# EAGLE design ASD2413 (EAGLE 6.3)
DATABASE: ./../../../../../Components/TinyCircuits_Part_Database.txt
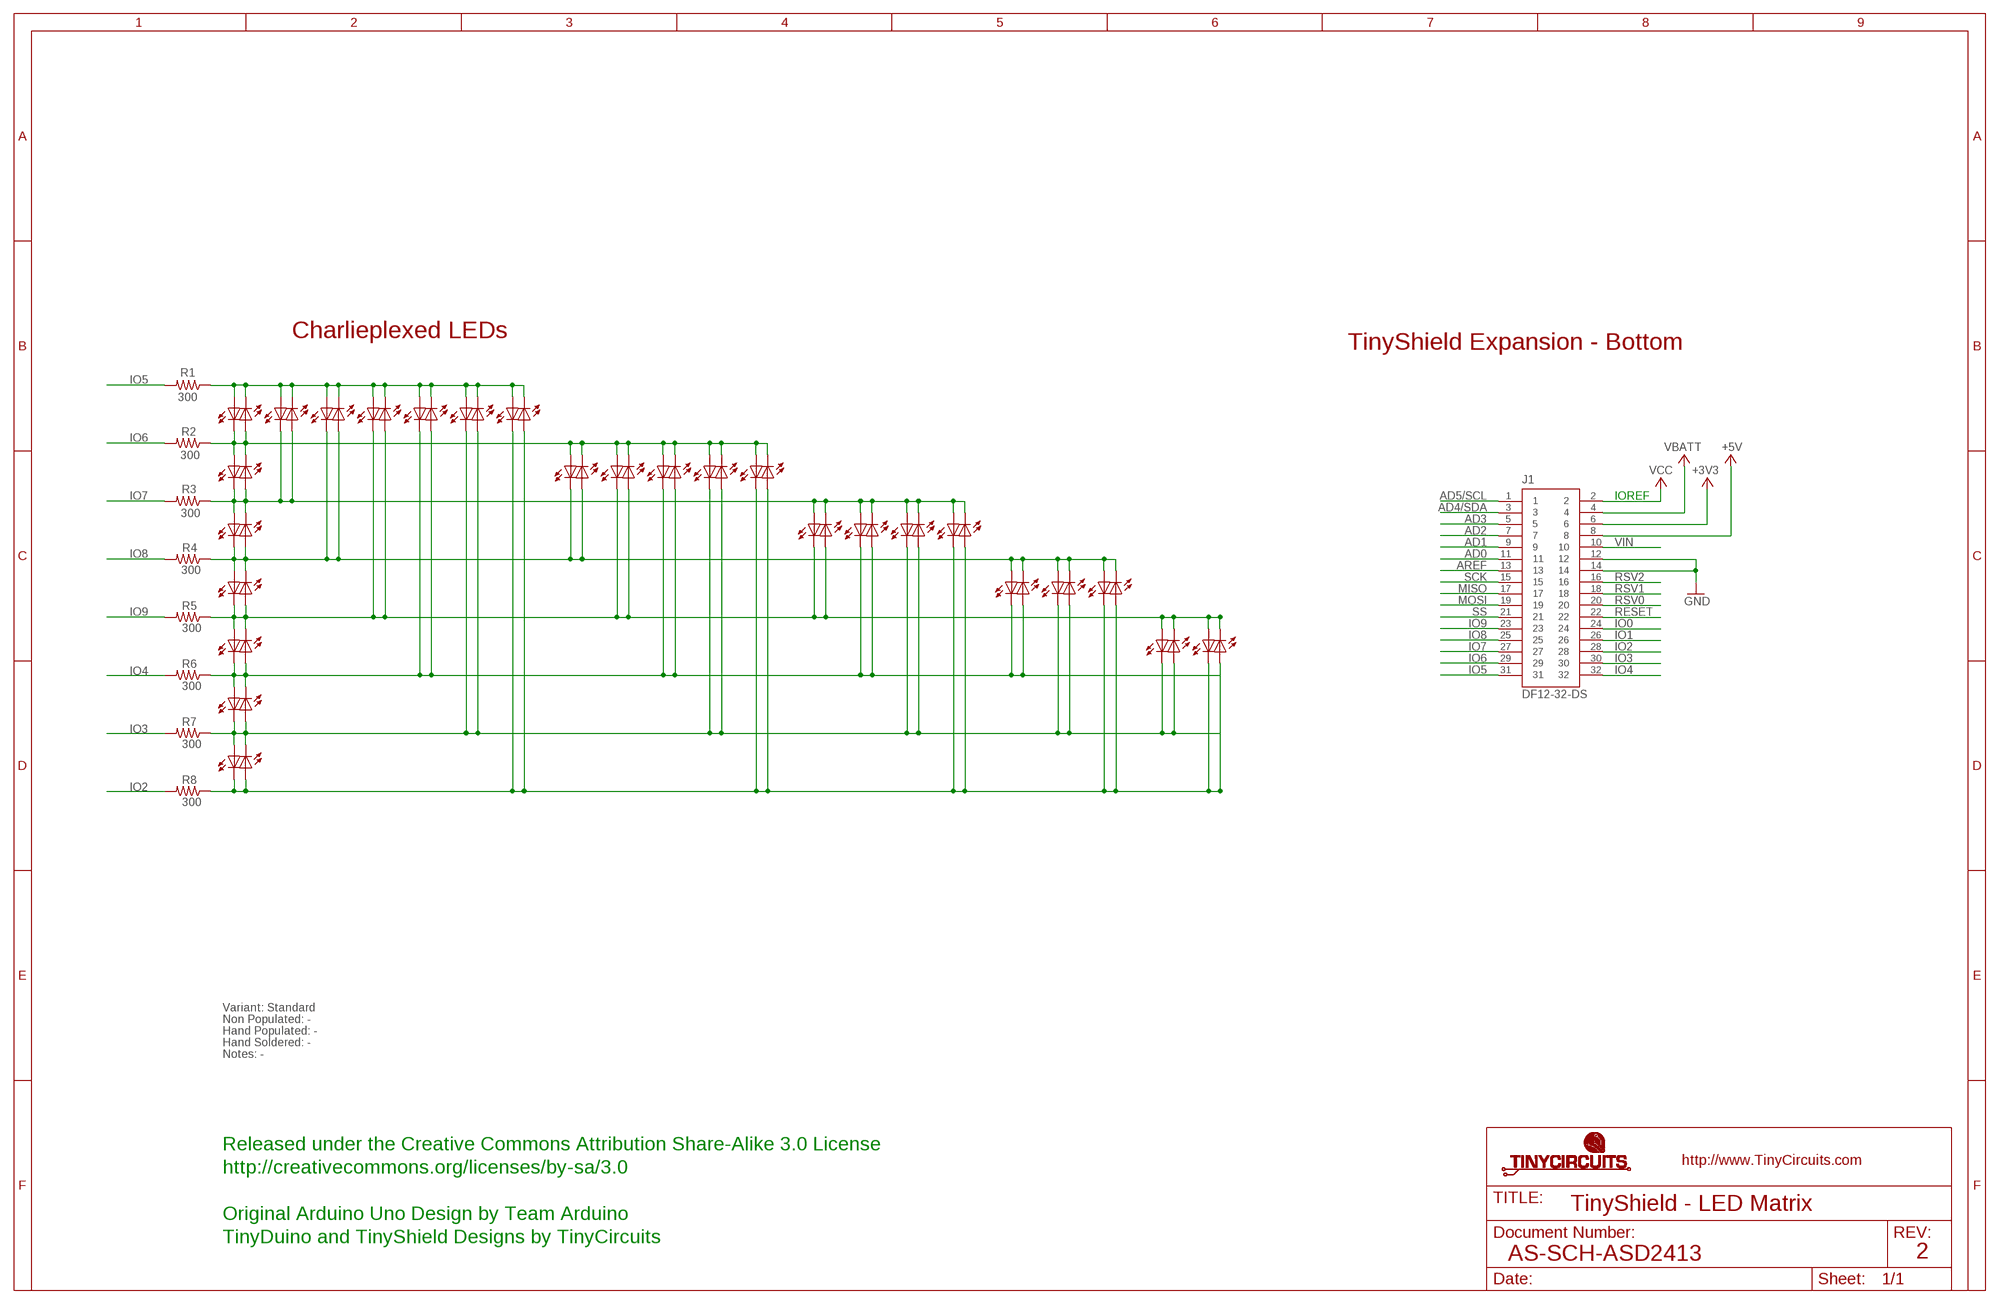
[diagram p0: schematic, sheet 1]

## Parts
D1  GREEN  AS-ITM-00038  [0402_LED]
D2  GREEN  AS-ITM-00038  [0402_LED]
D3  GREEN  AS-ITM-00038  [0402_LED]
D4  GREEN  AS-ITM-00038  [0402_LED]
D5  GREEN  AS-ITM-00038  [0402_LED]
D6  GREEN  AS-ITM-00038  [0402_LED]
D7  GREEN  AS-ITM-00038  [0402_LED]
D8  GREEN  AS-ITM-00038  [0402_LED]
D9  GREEN  AS-ITM-00038  [0402_LED]
D10  GREEN  AS-ITM-00038  [0402_LED]
D11  GREEN  AS-ITM-00038  [0402_LED]
D12  GREEN  AS-ITM-00038  [0402_LED]
D13  GREEN  AS-ITM-00038  [0402_LED]
D14  GREEN  AS-ITM-00038  [0402_LED]
D15  GREEN  AS-ITM-00038  [0402_LED]
D16  GREEN  AS-ITM-00038  [0402_LED]
D17  GREEN  AS-ITM-00038  [0402_LED]
D18  GREEN  AS-ITM-00038  [0402_LED]
D19  GREEN  AS-ITM-00038  [0402_LED]
D20  GREEN  AS-ITM-00038  [0402_LED]
D21  GREEN  AS-ITM-00038  [0402_LED]
D22  GREEN  AS-ITM-00038  [0402_LED]
D23  GREEN  AS-ITM-00038  [0402_LED]
D24  GREEN  AS-ITM-00038  [0402_LED]
D25  GREEN  AS-ITM-00038  [0402_LED]
D26  GREEN  AS-ITM-00038  [0402_LED]
D27  GREEN  AS-ITM-00038  [0402_LED]
D28  GREEN  AS-ITM-00038  [0402_LED]
D29  GREEN  AS-ITM-00038  [0402_LED]
D30  GREEN  AS-ITM-00038  [0402_LED]
D31  GREEN  AS-ITM-00038  [0402_LED]
D32  GREEN  AS-ITM-00038  [0402_LED]
D33  GREEN  AS-ITM-00038  [0402_LED]
D34  GREEN  AS-ITM-00038  [0402_LED]
D35  GREEN  AS-ITM-00038  [0402_LED]
D36  GREEN  AS-ITM-00038  [0402_LED]
D37  GREEN  AS-ITM-00038  [0402_LED]
D38  GREEN  AS-ITM-00038  [0402_LED]
D39  GREEN  AS-ITM-00038  [0402_LED]
D40  GREEN  AS-ITM-00038  [0402_LED]
D41  GREEN  AS-ITM-00038  [0402_LED]
D42  GREEN  AS-ITM-00038  [0402_LED]
D43  GREEN  AS-ITM-00038  [0402_LED]
D44  GREEN  AS-ITM-00038  [0402_LED]
D45  GREEN  AS-ITM-00038  [0402_LED]
D46  GREEN  AS-ITM-00038  [0402_LED]
D47  GREEN  AS-ITM-00038  [0402_LED]
D48  GREEN  AS-ITM-00038  [0402_LED]
D49  GREEN  AS-ITM-00038  [0402_LED]
D50  GREEN  AS-ITM-00038  [0402_LED]
D51  GREEN  AS-ITM-00038  [0402_LED]
D52  GREEN  AS-ITM-00038  [0402_LED]
D53  GREEN  AS-ITM-00038  [0402_LED]
D54  GREEN  AS-ITM-00038  [0402_LED]
J1  DF12-32-DS  AS-ITM-00012  [DF12-32-DS]
R1  300  AS-ITM-00016  [0402]
R2  300  AS-ITM-00016  [0402]
R3  300  AS-ITM-00016  [0402]
R4  300  AS-ITM-00016  [0402]
R5  300  AS-ITM-00016  [0402]
R6  300  AS-ITM-00016  [0402]
R7  300  AS-ITM-00016  [0402]
R8  300  AS-ITM-00016  [0402]

## Nets
+3V3: J1.6
+5V: J1.8
AD0: J1.11
AD1: J1.9
AD2: J1.7
AD3: J1.5
AD4/SDA: J1.3
AD5/SCL: J1.1
AREF: J1.13
GND: J1.12 J1.14
IO0: J1.24
IO1: J1.26
IO2: J1.28 R8.2
IO3: J1.30 R7.2
IO4: J1.32 R6.2
IO5: J1.31 R1.2
IO6: J1.29 R2.2
IO7: J1.27 R3.2
IO8: J1.25 R4.2
IO9: J1.23 R5.2
MISO: J1.17
MOSI: J1.19
N$2: D1.2(C) D2.1(A) D8.1(A) D9.2(C) D27.1(A) D28.2(C) D29.1(A) D30.2(C) D31.1(A) D32.2(C) D33.1(A) D34.2(C) D35.1(A) D36.2(C) R2.1
N$5: D3.2(C) D4.1(A) D10.1(A) D11.2(C) D17.2(C) D18.1(A) D27.2(C) D28.1(A) D45.1(A) D46.2(C) D47.1(A) D48.2(C) D49.1(A) D50.2(C) R4.1
N$6: D5.2(C) D6.1(A) D12.1(A) D13.2(C) D21.2(C) D22.1(A) D31.2(C) D32.1(A) D39.2(C) D40.1(A) D45.2(C) D46.1(A) R6.1
N$7: D7.2(C) D14.1(A) D25.2(C) D26.1(A) D35.2(C) D36.1(A) D43.2(C) D44.1(A) D49.2(C) D50.1(A) D53.2(C) D54.1(A) R8.1
N$11: D1.1(A) D8.2(C) D15.1(A) D16.2(C) D17.1(A) D18.2(C) D19.1(A) D20.2(C) D21.1(A) D22.2(C) D23.1(A) D24.2(C) D25.1(A) D26.2(C) R1.1
N$13: D2.2(C) D3.1(A) D9.1(A) D10.2(C) D15.2(C) D16.1(A) D37.1(A) D38.2(C) D39.1(A) D40.2(C) D41.1(A) D42.2(C) D43.1(A) D44.2(C) R3.1
N$14: D6.2(C) D7.1(A) D13.1(A) D14.2(C) D23.2(C) D24.1(A) D33.2(C) D34.1(A) D41.2(C) D42.1(A) D47.2(C) D48.1(A) D51.2(C) D52.1(A) R7.1
N$15: D4.2(C) D5.1(A) D11.1(A) D12.2(C) D19.2(C) D20.1(A) D29.2(C) D30.1(A) D37.2(C) D38.1(A) D51.1(A) D52.2(C) D53.1(A) D54.2(C) R5.1
RESET: J1.22
RSV0: J1.20
RSV1: J1.18
RSV2: J1.16
SCK: J1.15
SS: J1.21
VBATT: J1.4
VCC: J1.2
VIN: J1.10

## Notes on the sheet
- Charlieplexed LEDs
- TinyShield Expansion - Bottom
- IOREF
- Variant: Standard
- Non Populated: -
- Hand Populated: -
- Hand Soldered: -
- Notes: -
- Released under the Creative Commons Attribution Share-Alike 3.0 License
- http://creativecommons.org/licenses/by-sa/3.0
- TinyShield - LED Matrix
- Original Arduino Uno Design by Team Arduino
- TinyDuino and TinyShield Designs by TinyCircuits
- AS-SCH-ASD2413 | 2

## Library data of the parts
D1-D54 = tinycircuits:AS-ITM-00038: LED 0402 GREEN WTR CLR SMD; PARTNO: AS-ITM-00038
J1 = tinycircuits:AS-ITM-00012: CONN RECEPT 32POS 3MM SMD 0.5MM; PARTNO: AS-ITM-00012
R1-R8 = tinycircuits:AS-ITM-00016: RES 300 OHM 1/16W 1% 0402; PARTNO: AS-ITM-00016

## Board
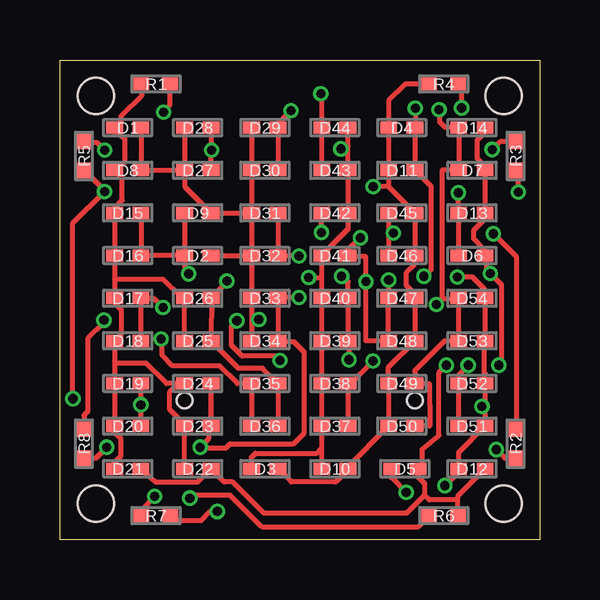
[diagram p1: board, top side]
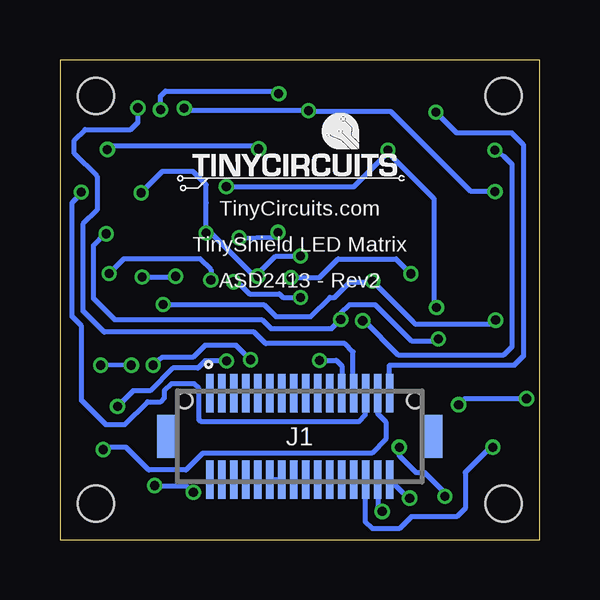
[diagram p2: board, bottom side, seen from below]

Size 20 x 20 mm. Coordinates in mm from the lower left corner, seen from the top.
Outline: 0,20 20,20 20,0 0,0 0,20
Copper layers (1*16): Top 0.035mm / dielectric 1.5mm / Bottom 0.035mm
Design rules "default *": minimum track width 8mil, minimum drill 12mil, track to track 7mil, track to pad 7mil, pad to pad 7mil, via to via 7mil, smd to smd 7mil, copper to edge 7mil, drill to drill 7mil, minimum pad ring 10mil, minimum via ring 5mil, stop-mask expansion 4mil, vias tented up to drill 25mil, thermal gap 10mil
Holes 1.5 mm at 1.5,18.5 18.5,18.5 18.5,1.5 1.5,1.5

### Footprints (pad centres in the part's own frame; a part is rotated, then mirrored left to right if it is on the bottom)
0402_LED = smd 0.7 x 0.5: 1 -0.55,0; 2 0.55,0
DF12-32-DS = smd 0.3 x 1.6: 1 -3.75,1.8; 2 -3.75,-1.8; 3 -3.25,1.8; 4 -3.25,-1.8; 5 -2.75,1.8; 6 -2.75,-1.8; 7 -2.25,1.8; 8 -2.25,-1.8; 9 -1.75,1.8; 10 -1.75,-1.8; 11 -1.25,1.8; 12 -1.25,-1.8; 13 -0.75,1.8; 14 -0.75,-1.8; 15 -0.25,1.8; 16 -0.25,-1.8; 17 0.25,1.8; 18 0.25,-1.8; 19 0.75,1.8; 20 0.75,-1.8; 21 1.25,1.8; 22 1.25,-1.8; 23 1.75,1.8; 24 1.75,-1.8; 25 2.25,1.8; 26 2.25,-1.8; 27 2.75,1.8; 28 2.75,-1.8; 29 3.25,1.8; 30 3.25,-1.8; 31 3.75,1.8; 32 3.75,-1.8 | smd 0.9 x 1.8: F1 -5.5,0; F2 5.5,0 | hole 0.65: -4.8,1.5; 4.8,1.5
0402 = smd 0.65 x 0.55: 1 -0.6,0; 2 0.6,0

### Placement (x,y rotation side)
D1  2.83,17.18 0 top
D2  5.75,11.84 180 top
D3  8.54,2.95 0 top
D4  14.26,17.18 0 top
D5  14.38,2.95 0 top
D6  17.18,11.84 0 top
D7  17.18,15.4 180 top
D8  2.83,15.4 180 top
D9  5.75,13.62 0 top
D10  11.46,2.95 180 top
D11  14.26,15.4 180 top
D12  17.18,2.95 180 top
D13  17.18,13.62 180 top
D14  17.18,17.18 0 top
D15  2.83,13.62 0 top
D16  2.83,11.84 180 top
D17  2.83,10.07 0 top
D18  2.83,8.29 180 top
D19  2.83,6.51 0 top
D20  2.83,4.73 180 top
D21  2.83,2.95 0 top
D22  5.75,2.95 180 top
D23  5.75,4.73 0 top
D24  5.75,6.51 180 top
D25  5.75,8.29 0 top
D26  5.75,10.07 180 top
D27  5.75,15.4 0 top
D28  5.75,17.18 180 top
D29  8.54,17.18 0 top
D30  8.54,15.4 180 top
D31  8.54,13.62 0 top
D32  8.54,11.84 180 top
D33  8.54,10.07 0 top
D34  8.54,8.29 180 top
D35  8.54,6.51 0 top
D36  8.54,4.73 180 top
D37  11.46,4.73 0 top
D38  11.46,6.51 180 top
D39  11.46,8.29 0 top
D40  11.46,10.07 180 top
D41  11.46,11.84 0 top
D42  11.46,13.62 0 top
D43  11.46,15.4 180 top
D44  11.46,17.18 0 top
D45  14.26,13.62 180 top
D46  14.26,11.84 0 top
D47  14.26,10.07 180 top
D48  14.26,8.29 0 top
D49  14.26,6.51 0 top
D50  14.26,4.73 180 top
D51  17.18,4.73 180 top
D52  17.18,6.51 0 top
D53  17.18,8.29 180 top
D54  17.18,10.07 0 top
J1  10,4.3 0 bottom
R1  4,19 0 top
R2  19,4 270 top
R3  19,16 270 top
R4  16,19 0 top
R5  1,16 90 top
R6  16,1 180 top
R7  4,1 0 top
R8  1,4 270 top
U$1  [DOCFIELD-TINYCIRCUITS-PCB]  33.91,-10 0 top  (outside the outline)

### Tracks (layer width: path | path; a pad name or v marks a point on that pad's centre or on a via)
+3V3
  Bottom 0.254: 12.74,2.51 J1.6
GND
  Bottom 0.254: J1.12 J1.14
IO2  (via drill 0.38)
  Top 0.203: R8.2 1.5,3.4 v1.95,3.85
  Bottom 0.203: J1.28 7.27,2.5 7.27,0.75 6.97,0.45 5.85,0.45 5.35,0.95 3.45,0.95 3.1,1.3 3.1,2.8 2.05,3.85 v1.95,3.85
IO3  (via drill 0.38)
  Top 0.203: R7.2 4.8,0.8 5.9,0.8 6.27,1.17 v6.56,1.17
  Bottom 0.203: 6.76,2.5 J1.30 6.75,1.36 v6.56,1.17
IO4  (via drill 0.38)
  Top 0.203: v5.42,1.72 5.54,1.85 7.1,1.85 8.41,0.54 14.94,0.54 R6.2
  Bottom 0.203: 6.21,3.14 6.26,3.14 | v5.42,1.72 5.68,1.92 J1.32
  Bottom 0.254: 6.21,3.14 6.26,3.1 J1.32
IO5  (via drill 0.38)
  Top 0.203: v4.32,17.82 4.59,18.12 R1.2
  Bottom 0.203: J1.31 6.26,7.27 1.05,7.27 0.67,7.65 0.67,16.47 1.15,16.95 3.45,16.95 v4.32,17.82
IO6  (via drill 0.38)
  Top 0.203: R2.2 18.55,3.4 v18.2,3.75
  Bottom 0.203: J1.29 6.76,6.1 | 6.71,6.06 J1.29 | J1.29 6.75,5.25 6.41,4.91 6.41,4.19 7,3.6 14.05,3.6 14.75,2.9 16.3,2.9 17.25,3.85 18.1,3.85 v18.2,3.75
IO7  (via drill 0.38)
  Top 0.203: R3.2 19.01,15.31 19.1,15.15 19.1,14.51 v19.11,14.49
  Bottom 0.203: J1.27 7.27,6.1 7.27,5.19 7.55,4.91 14.11,4.91 14.2,5 14.2,6.3 14.4,6.5 15.35,6.5 15.65,6.2 15.65,5.9 15.8,5.75 16.35,5.75 17.3,4.8 18.1,4.8 19.1,5.8 19.1,8.9 19.5,9.3 19.5,14.05 19.11,14.44 v19.11,14.49
IO8  (via drill 0.38)
  Top 0.203: 16.59,19.04 R4.2 16.75,18.78 v16.75,18
  Bottom 0.203: J1.25 7.78,6.1 7.78,7.83 8.12,8.18 11.43,8.18 11.9,8.65 18.15,8.65 19.05,9.55 19.05,13.15 18.45,13.75 18.45,15.15 19.4,16.1 19.4,16.65 18.95,17.1 17.05,17.1 16.75,17.4 v16.75,18
IO9  (via drill 0.38)
  Top 0.203: v9.18,7.47 9,7.65 7.6,7.65 7.15,8.1 7.15,8.9 v7.37,9.13 | v1.87,16.24 v1.86,16.24 1.55,16.55 1.05,16.55 R5.2
  Bottom 0.203: v7.37,9.13 7.33,9.13 5.9,7.7 1.48,7.7 1.15,8.03 1.15,15.65 1.49,15.99 v1.87,16.24 | v9.18,7.47 8.47,7.47 8.25,7.25 J1.23
N$2  (via drill 0.38)
  Top 0.203: D1.2 D8.1 D27.1 | D28.2 D27.1 | D27.1 5.2,14.72 D9.2 D31.1 | D29.1 D30.2 D31.1 | D31.1 D32.2 | D32.2 D33.1 7.99,9.18 | 7.99,9.18 D34.2 | D36.2 D35.1 7.4,6.51 6.66,7.25 4.7,7.25 4.25,7.7 4.25,8.34 v4.22,8.36 | v8.29,9.18 7.99,9.18 | D2.1 D32.2 | v18.08,12.75 19.05,11.78 19.05,4.65 R2.1
  Bottom 0.203: 4.35,8.37 4.35,8.36 v4.22,8.36 4.3,8.29 5.34,8.29 5.8,8.75 6.05,9 6.06,9 6.85,9.79 7.93,9.79 8.29,9.43 v8.29,9.18 8.67,8.8 11.2,8.8 11.58,9.18 17.73,9.18 18.6,10.05 18.6,12.28 18.13,12.75 v18.08,12.75
N$5  (via drill 0.38)
  Top 0.203: D18.1 D17.2 3.91,10.07 v4.29,9.68 | D10.1 11.97,2.95 | 13.71,14.72 D11.2 D4.1 13.7,18.3 14.4,19 R4.1 | 13.71,14.72 D45.1 D46.2 14.8,11.5 14.45,11.15 14.45,10.6 14.81,10.24 D47.1 D48.2 13.71,7.19 D49.1 D50.2 12.01,3.04 D10.1 | 13.71,14.72 13.06,14.72 v13.06,14.71 | D10.1 12.01,2.91 11.5,2.4 9.65,2.4 D3.2 | D28.1 6.3,16.26 v6.32,16.24 6.3,16.21 D27.2
  Bottom 0.203: v13.06,14.71 7.75,14.71 6.32,16.14 | v4.29,9.68 4.4,9.78 4.4,14.21 6.32,16.14 | 6.32,16.14 v6.32,16.24
N$6  (via drill 0.38)
  Top 0.203: D31.2 D32.1 9.12,11.82 v9.96,11.82 | D45.2 13.71,12.78 | 13.71,12.78 D46.1 | D21.2 3.99,2.4 5.74,2.4 D22.1 | D6.1 D13.2 16.64,13.62 v16.62,14.46 | v13.91,12.78 13.71,12.78 | v12.05,7.5 12.05,8.29 D39.2 D40.1 12.01,10.77 v11.75,10.98 | v16.11,7.27 15.81,6.97 15.81,4.35 15.1,3.77 15.1,3.12 D5.2 14.93,2.62 15.2,2.35 15.2,1.85 | D22.1 | D22.1 6.85,2.4 7.2,2.4 8.5,1.1 14.45,1.1 15.2,1.85 | D12.1 16.6,1.83 16.6,1.8 | R6.1 16.6,1.8 | 16.6,1.8 16.55,1.65 15.4,1.65 15.2,1.85
  Bottom 0.203: v11.75,10.98 12,11.07 | 12,11.07 13.71,12.78 v13.91,12.78 13.91,13.69 13.9,14.05 13.9,14.8 14.45,15.35 15.73,15.35 v16.62,14.46 | 12,11.07 11.75,11.07 11.01,11.82 v9.96,11.82 | v12.05,7.5 12.65,8.1 13.95,8.1 14.45,7.6 15.73,7.6 v16.11,7.27
N$7  (via drill 0.38)
  Top 0.203: D25.2 6.32,10.17 D26.1 6.96,10.73 v6.96,10.78 | D36.1 D35.2 8.46,7.14 7.44,7.14 D25.2 | D43.2 D44.1 10.91,18.45 v10.88,18.6 | D50.1 15.43,4.73 15.4,6.51 D49.2 14.8,7.05 16.04,8.29 D53.2 16.63,10.04 | D25.2 6.38,8.29 | 16.63,10.04 D54.1 | 16.63,10.04 15.94,10.04 v15.7,9.8 15.93,10.03 15.93,15.4 D7.2 D14.1 16.07,17.18 15.85,17.4 15.85,17.88 v15.81,17.92 | v1.84,9.15 1.84,9.06 1.18,8.4 1.18,5.37 1,5.19 R8.1
  Bottom 0.203: v15.81,17.92 15.81,18.49 15.6,18.7 10.98,18.7 v10.88,18.6 | v15.7,9.8 11.5,9.8 11,9.3 9.55,9.3 8.75,10.1 8.55,10.1 7.9,10.75 6.99,10.75 v6.96,10.78 5.29,9.1 5.29,9.09 5.2,9 1.99,9 v1.84,9.15
N$11
  Top 0.203: 2.28,7.44 D19.1 D20.2 2.25,4.71 2.25,4.5 2.55,4.2 2.55,3.5 2.28,3.23 D21.1 | 2.28,7.44 D18.2 2.55,8.56 2.55,9.6 2.28,9.87 D17.1 2.28,10.85 | D22.2 D23.1 5.2,4.8 4.58,5.42 4.58,6.15 4.94,6.51 D24.2 4.44,6.51 3.6,7.35 2.37,7.35 2.28,7.44 | D26.2 5.08,10.07 | 2.28,10.85 D16.2 D15.1 2.28,13.83 2.6,14.15 2.6,15.08 D8.2 2.7,15.72 2.7,16.72 2.28,16.99 D1.1 2.55,17.45 2.55,17.65 3.4,18.5 R1.1 | D26.2 5.08,10.07 4.3,10.85 2.28,10.85 | D25.1 D26.2
N$13  (via drill 0.38)
  Top 0.203: D15.2 D16.1 D2.2 | D9.1 D2.2 | 12.01,16.42 D43.1 D42.2 12.01,12.94 D41.1 10.91,10.93 | 12.01,16.42 D44.2 | 10.91,10.93 D40.2 D39.1 D38.2 D37.1 10.91,3.8 | 10.91,3.8 D10.2 | R3.1 18.35,16.59 v18.02,16.27 | v11.71,16.29 11.89,16.29 12.01,16.42 | D2.2 5.2,11.25 v5.37,11.08 | v10.37,10.93 10.91,10.93 | D3.1 7.98,3.43 8.15,3.6 10.71,3.6 10.91,3.8
  Bottom 0.203: v11.71,16.29 11.84,16.42 17.88,16.42 v18.02,16.27 | v10.37,10.93 9.17,10.93 8.4,11.7 5.98,11.7 v5.37,11.08
N$14  (via drill 0.38)
  Top 0.203: v13.71,10.83 D47.2 D48.1 12.76,8.29 v12.76,10.75 12.76,11.79 12.01,11.79 D41.2 12.01,12.14 v12.53,12.58 | D51.2 D52.1 16.63,6.87 v17.03,7.27 | D23.2 D24.1 6.3,4.71 6.19,4.71 6.19,4.19 v5.85,3.85 5.88,3.82 6.92,3.82 7.1,4 9.75,4 10.2,4.45 10.2,7.8 9.75,8.25 9.13,8.25 D34.1 D33.2 9.09,10.09 v9.96,10.09 | v10.9,12.81 D42.1 | v18.3,7.27 18.35,7.36 18.4,7.46 18.4,7.43 18.42,7.46 18.42,10.62 v17.95,11.09 17.78,11.26 17.78,11.79 D6.2 17.73,12.07 17.25,12.55 17.25,12.9 17.65,13.3 17.65,13.54 D13.1 D7.1 17.73,15.57 17.4,15.9 17.4,16.65 17.65,16.9 17.65,17.1 D14.2 | v3.95,1.8 3.4,1.25 R7.1
  Bottom 0.203: v13.71,10.83 13.71,11.26 14.15,11.7 17.34,11.7 v17.95,11.09 | 9.96,10.12 v9.96,10.09 9.97,10.1 10.7,10.1 10.85,10.25 12.1,10.25 12.6,10.75 v12.76,10.75 | v12.53,12.58 11.11,12.6 v10.9,12.81 | v17.03,7.27 v18.3,7.27 | v5.85,3.85 5.85,3.5 5.15,2.8 4.8,2.8 3.95,1.95 v3.95,1.8
N$15  (via drill 0.38)
  Top 0.203: D20.1 3.38,5.88 | 3.38,5.88 D19.2 | 17.73,5.7 D52.2 17.73,6.92 17.7,6.95 17.7,8.26 D53.1 D54.2 17.73,10.42 17.2,10.95 v16.58,10.95 | 17.73,5.7 D51.1 16.63,3.63 D12.2 16.63,2.83 v16.05,2.25 | v3.38,5.62 v3.37,5.62 3.38,5.88 | 13.79,2.95 D5.1 13.83,2.56 v14.43,1.96 | 9.05,15.36 D30.1 D29.2 9.09,17.35 v9.63,17.89 | v14.82,17.99 D4.2 D11.1 15.48,14.73 15.48,11.26 15.27,11.06 v15.18,10.98 | 12,4.73 D37.2 D38.1 12.16,6.51 v13.05,7.45 | v17.6,5.55 17.58,5.55 17.73,5.7 | v0.54,5.88 0.54,13.19 v1.86,14.51 1.86,14.54 R5.1
  Bottom 0.203: v0.54,5.88 3.12,5.88 v3.38,5.62 | 15.35,10.98 v15.18,10.98 15.2,10.95 v16.58,10.95 | v13.05,7.45 13.95,7.45 14.25,7.15 15.3,7.15 16.25,6.2 16.95,6.2 v17.6,5.55 | v16.05,2.25 14.72,2.25 v14.43,1.96 | v1.86,14.51 2.86,14.51 6.2,17.85 9.59,17.85 v9.63,17.89 14.72,17.89 v14.82,17.99

### Text on the board
bPlace: TinyCircuits.com | TinyShield LED Matrix | ASD2413 - Rev2
Document: FABRICATION DRAWING | NOTES: | 1. PRINTED CIRCUIT BOARD MADE FROM NEMA GRADE FR-4 EPOXY LAMINATE | WITH 1 OUNCE COPPER PLATING AND .024 THICKNESS. | 2. ALL DIMENSIONS ARE GIVEN IN INCHES. | 3. CIRCUIT PATHS ARE FOR REFERENCE ONLY. | 4. HOLE SIZES SHOWN ARE FINISHED DIAMETERS AFTER PLATING. | 5. BOARD PLATED USING REFLOW OR SIMILAR METHOD. | 6. BOARD TO HAVE GREEN SOLDER MASK ON PLATED SURFACES USING WET FILM | 7. SILKSCREEN BOARD USING WHITE INK. | SR100 OR SR1010 EPOXY. EQUIVALENT WET OR DRY FILM MAY BE USED. | 8. THE FOLLOWING INFORMATION APPLIES TO THIS BOARD: | * 2 COPPER LAYERS | * .024 BOARD THICKNESS | * REQUIRES TOP SIDE SILKSCREEN | TinyShield - LED Matrix | AS-PCB-ASD2413 | 2